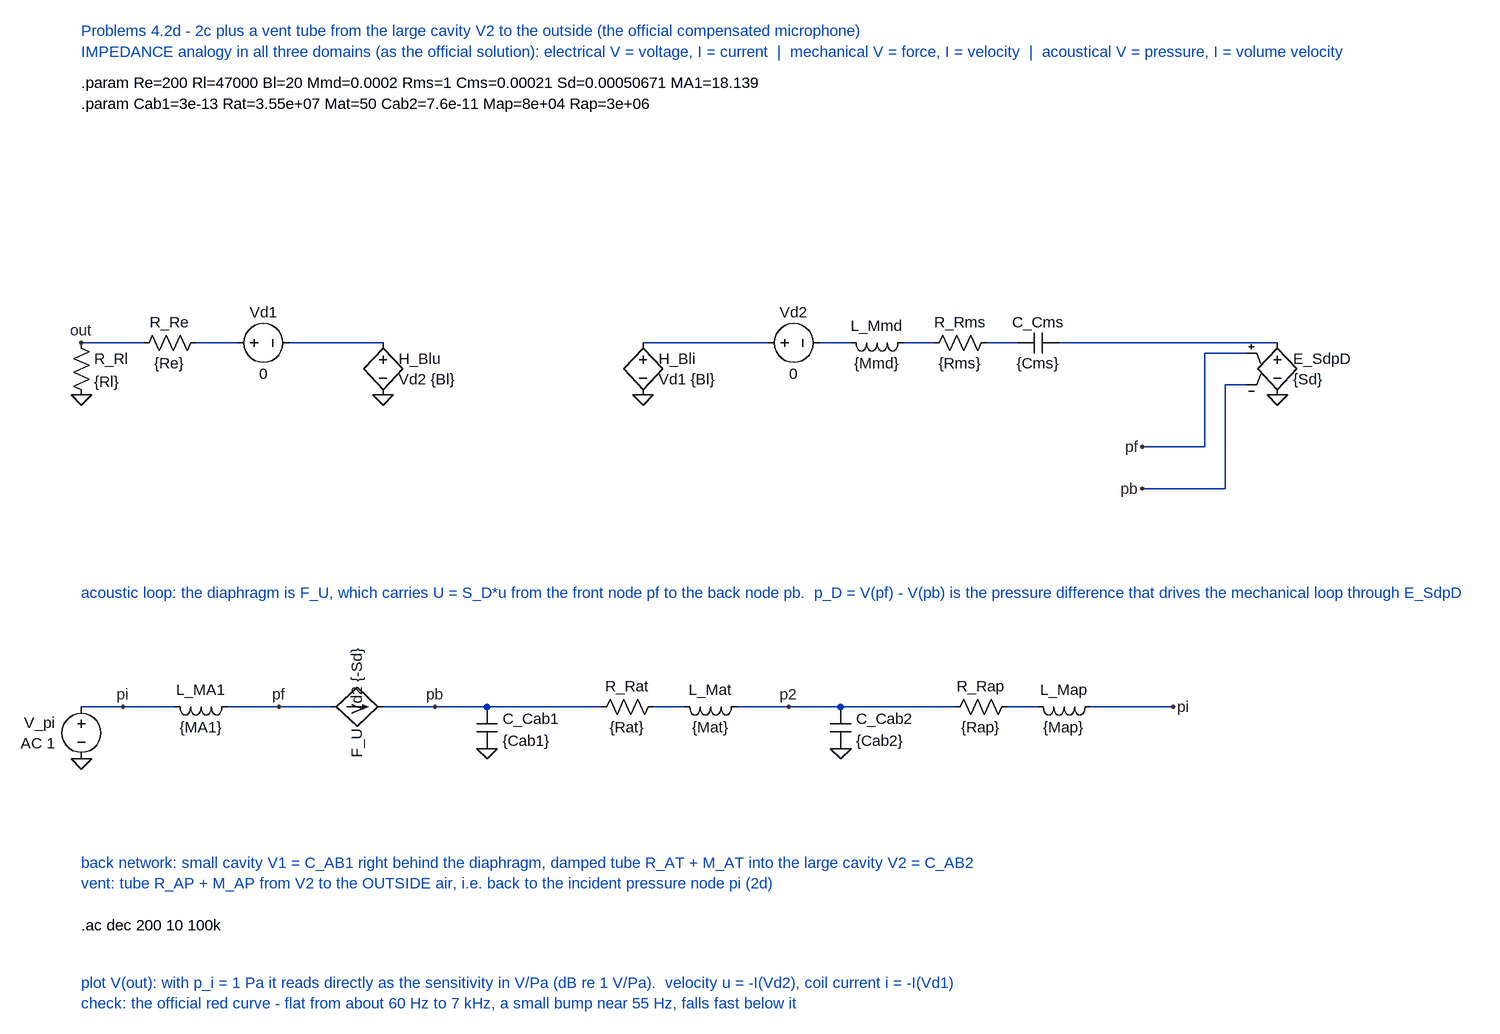
[diagram p0: schematic P4_2d_Vent.asc]
P4_2d_Vent.asc, the LTspice schematic file:
Version 4
SHEET 1 3000 1600
WIRE 0 0 96 0
WIRE 176 0 240 0
WIRE 320 0 464 0
WIRE 864 0 1056 0
WIRE 1136 0 1184 0
WIRE 1264 0 1312 0
WIRE 1392 0 1440 0
WIRE 1504 0 1840 0
WIRE 1792 16 1728 16
WIRE 1728 16 1728 160
WIRE 1728 160 1632 160
WIRE 1792 64 1760 64
WIRE 1760 64 1760 224
WIRE 1760 224 1632 224
WIRE 0 560 144 560
WIRE 224 560 384 560
WIRE 464 560 624 560
WIRE 624 560 800 560
WIRE 880 560 928 560
WIRE 1008 560 1168 560
WIRE 1168 560 1344 560
WIRE 1424 560 1472 560
WIRE 1552 560 1680 560
FLAG 0 80 0
FLAG 0 0 out
FLAG 464 80 0
FLAG 864 80 0
FLAG 1840 80 0
FLAG 1632 160 pf
FLAG 1632 224 pb
FLAG 0 640 0
FLAG 64 560 pi
FLAG 304 560 pf
FLAG 544 560 pb
FLAG 624 624 0
FLAG 1088 560 p2
FLAG 1168 624 0
FLAG 1680 560 pi
SYMBOL res -16 -16 R0
SYMATTR InstName R_Rl
SYMATTR Value {Rl}
SYMBOL res 192 -16 R90
WINDOW 0 0 56 VBottom 2
WINDOW 3 32 56 VTop 2
SYMATTR InstName R_Re
SYMATTR Value {Re}
SYMBOL voltage 224 0 R270
WINDOW 0 32 56 VTop 2
WINDOW 3 -32 56 VBottom 2
SYMATTR InstName Vd1
SYMATTR Value 0
SYMBOL h 464 -16 R0
WINDOW 0 24 40 Left 2
WINDOW 3 24 72 Left 2
SYMATTR InstName H_Blu
SYMATTR Value Vd2 {Bl}
SYMBOL h 864 -16 R0
WINDOW 0 24 40 Left 2
WINDOW 3 24 72 Left 2
SYMATTR InstName H_Bli
SYMATTR Value Vd1 {Bl}
SYMBOL voltage 1040 0 R270
WINDOW 0 32 56 VTop 2
WINDOW 3 -32 56 VBottom 2
SYMATTR InstName Vd2
SYMATTR Value 0
SYMBOL ind 1280 -16 R90
WINDOW 0 5 56 VBottom 2
WINDOW 3 32 56 VTop 2
SYMATTR InstName L_Mmd
SYMATTR Value {Mmd}
SYMATTR SpiceLine Rser=0
SYMBOL res 1408 -16 R90
WINDOW 0 0 56 VBottom 2
WINDOW 3 32 56 VTop 2
SYMATTR InstName R_Rms
SYMATTR Value {Rms}
SYMBOL cap 1504 -16 R90
WINDOW 0 0 32 VBottom 2
WINDOW 3 32 32 VTop 2
SYMATTR InstName C_Cms
SYMATTR Value {Cms}
SYMBOL e 1840 -16 R0
WINDOW 0 24 40 Left 2
WINDOW 3 24 72 Left 2
SYMATTR InstName E_SdpD
SYMATTR Value {Sd}
SYMBOL voltage 0 544 R0
WINDOW 0 -40 40 Right 2
WINDOW 3 -40 72 Right 2
SYMATTR InstName V_pi
SYMATTR Value AC 1
SYMBOL ind 240 544 R90
WINDOW 0 5 56 VBottom 2
WINDOW 3 32 56 VTop 2
SYMATTR InstName L_MA1
SYMATTR Value {MA1}
SYMATTR SpiceLine Rser=0
SYMBOL f 384 560 R270
WINDOW 0 -56 40 Center 2
WINDOW 3 40 40 Center 2
SYMATTR InstName F_U
SYMATTR Value Vd2 {-Sd}
SYMBOL cap 608 560 R0
WINDOW 0 40 18 Left 2
WINDOW 3 40 52 Left 2
SYMATTR InstName C_Cab1
SYMATTR Value {Cab1}
SYMBOL res 896 544 R90
WINDOW 0 0 56 VBottom 2
WINDOW 3 32 56 VTop 2
SYMATTR InstName R_Rat
SYMATTR Value {Rat}
SYMBOL ind 1024 544 R90
WINDOW 0 5 56 VBottom 2
WINDOW 3 32 56 VTop 2
SYMATTR InstName L_Mat
SYMATTR Value {Mat}
SYMATTR SpiceLine Rser=0
SYMBOL cap 1152 560 R0
WINDOW 0 40 18 Left 2
WINDOW 3 40 52 Left 2
SYMATTR InstName C_Cab2
SYMATTR Value {Cab2}
SYMBOL res 1440 544 R90
WINDOW 0 0 56 VBottom 2
WINDOW 3 32 56 VTop 2
SYMATTR InstName R_Rap
SYMATTR Value {Rap}
SYMBOL ind 1568 544 R90
WINDOW 0 5 56 VBottom 2
WINDOW 3 32 56 VTop 2
SYMATTR InstName L_Map
SYMATTR Value {Map}
SYMATTR SpiceLine Rser=0
TEXT 0 -480 Left 2 ;Problems 4.2d - 2c plus a vent tube from the large cavity V2 to the outside (the official compensated microphone)
TEXT 0 -448 Left 2 ;IMPEDANCE analogy in all three domains (as the official solution): electrical V = voltage, I = current  |  mechanical V = force, I = velocity  |  acoustical V = pressure, I = volume velocity
TEXT 0 -400 Left 2 !.param Re=200 Rl=47000 Bl=20 Mmd=0.0002 Rms=1 Cms=0.00021 Sd=0.00050671 MA1=18.139
TEXT 0 -368 Left 2 !.param Cab1=3e-13 Rat=3.55e+07 Mat=50 Cab2=7.6e-11 Map=8e+04 Rap=3e+06
TEXT 0 384 Left 2 ;acoustic loop: the diaphragm is F_U, which carries U = S_D*u from the front node pf to the back node pb.  p_D = V(pf) - V(pb) is the pressure difference that drives the mechanical loop through E_SdpD
TEXT 0 800 Left 2 ;back network: small cavity V1 = C_AB1 right behind the diaphragm, damped tube R_AT + M_AT into the large cavity V2 = C_AB2\nvent: tube R_AP + M_AP from V2 to the OUTSIDE air, i.e. back to the incident pressure node pi (2d)
TEXT 0 896 Left 2 !.ac dec 200 10 100k
TEXT 0 984 Left 2 ;plot V(out): with p_i = 1 Pa it reads directly as the sensitivity in V/Pa (dB re 1 V/Pa).  velocity u = -I(Vd2), coil current i = -I(Vd1)
TEXT 0 1016 Left 2 ;check: the official red curve - flat from about 60 Hz to 7 kHz, a small bump near 55 Hz, falls fast below it

The netlist it stands for:
* P4_2d_Vent.asc
R_Rl out 0 {Rl}
R_Re N001 out {Re}
Vd1 N001 N002 0
H_Blu N002 0 Vd2 {Bl}
H_Bli N003 0 Vd1 {Bl}
Vd2 N003 N004 0
L_Mmd N005 N004 {Mmd} Rser=0
R_Rms N006 N005 {Rms}
C_Cms N007 N006 {Cms}
E_SdpD N007 0 pf pb {Sd}
V_pi pi 0 AC 1
L_MA1 pf pi {MA1} Rser=0
F_U pf pb Vd2 {-Sd}
C_Cab1 pb 0 {Cab1}
R_Rat N008 pb {Rat}
L_Mat p2 N008 {Mat} Rser=0
C_Cab2 p2 0 {Cab2}
R_Rap N009 p2 {Rap}
L_Map pi N009 {Map} Rser=0
* Problems 4.2d - 2c plus a vent tube from the large cavity V2 to the outside (the official compensated microphone)
* IMPEDANCE analogy in all three domains (as the official solution): electrical V = voltage, I = current  |  mechanical V = force, I = velocity  |  acoustical V = pressure, I = volume velocity
.param Re=200 Rl=47000 Bl=20 Mmd=0.0002 Rms=1 Cms=0.00021 Sd=0.00050671 MA1=18.139
.param Cab1=3e-13 Rat=3.55e+07 Mat=50 Cab2=7.6e-11 Map=8e+04 Rap=3e+06
* acoustic loop: the diaphragm is F_U, which carries U = S_D*u from the front node pf to the back node pb.  p_D = V(pf) - V(pb) is the pressure difference that drives the mechanical loop through E_SdpD
* back network: small cavity V1 = C_AB1 right behind the diaphragm, damped tube R_AT + M_AT into the large cavity V2 = C_AB2
* vent: tube R_AP + M_AP from V2 to the OUTSIDE air, i.e. back to the incident pressure node pi (2d)
.ac dec 200 10 100k
* plot V(out): with p_i = 1 Pa it reads directly as the sensitivity in V/Pa (dB re 1 V/Pa).  velocity u = -I(Vd2), coil current i = -I(Vd1)
* check: the official red curve - flat from about 60 Hz to 7 kHz, a small bump near 55 Hz, falls fast below it
.backanno
.end